# Altium schematic sheet Column.SchDoc
size 420 x 297 mm; Address1: Address1; Address2: Address2; Address3: Address3; Address4: Address4; DocumentNumber: *Э3; SheetNumber: 8; SheetTotal: 14; DocumentType: Схема электрическая *
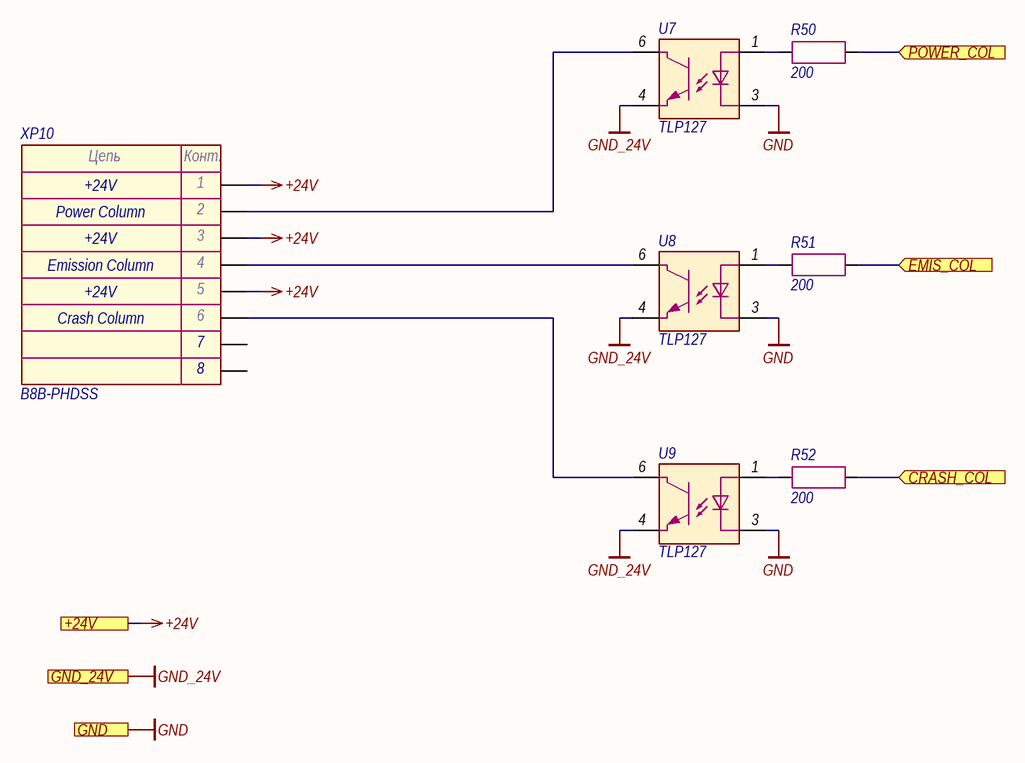
[diagram p0: Column.SchDoc]

## Parts
R50  200  [RES_0603]
R51  200  [RES_0603]
R52  200  [RES_0603]
U7  TLP127  [11-4C1]
U8  TLP127  [11-4C1]
U9  TLP127  [11-4C1]
XP10  B8B-PHDSS  [B8B-PHDSS]

## Ports
+24V (see Main[2C], Button[1C], Flow_sensor[2C], Indication[1C], LD_driver[1D]), CRASH_COL (in, see Main[2C]), EMIS_COL (in, see Main[2C]), GND (see Main[2C], Button[1D], Ethernet[3D], Fiber_interlock[2C], Flow_sensor[2C], Guide_laser[1C], Indication[1C], LD_driver[1D], Power_supply[2C], RS-485[2C]), GND_24V (see Main[2C], Button[1D], Flow_sensor[2C], Indication[1C], LD_driver[1D]), POWER_COL (in, see Main[2C])

## Nets
+24V: XP10.1 XP10.3 XP10.5 ; port +24V
GND: U7.3 U8.3 U9.3 ; port GND
GND_24V: U7.4 U8.4 U9.4 ; port GND_24V
CRASH_COL: R52.2 ; port CRASH_COL
EMIS_COL: R51.2 ; port EMIS_COL
POWER_COL: R50.2 ; port POWER_COL
NetR50_1: R50.1 U7.1
NetR51_1: R51.1 U8.1
NetR52_1: R52.1 U9.1
NetU7_6: U7.6 XP10.2
NetU8_6: U8.6 XP10.4
NetU9_6: U9.6 XP10.6

Not connected (* = marked no-connect by the designer): XP10 7 8

## Notes on the sheet
- Power Column
- +24V
- Emission Column
- Crash Column
- Подп. и дата
- Инв. № дубл.
- Взам. инв. №
- Инв. № подл.
- Изм.
- Лист
- № докум.
- Подп.
- Дата
- Копировал
- Формат А3
- (in symbol Connector-8) Цепь; Конт.

## Library data of the parts
R50-R52 = Resistor: Manufacturer: Yageo; Model: RC0603FR-07200RL; Value: 200; Document: *
U7-U9 = TLP127: Manufacturer: Toshiba; Model: TLP127; Document: *
XP10 = Connector-8: Manufacturer: JST; Model: B8B-PHDSS; Document: *